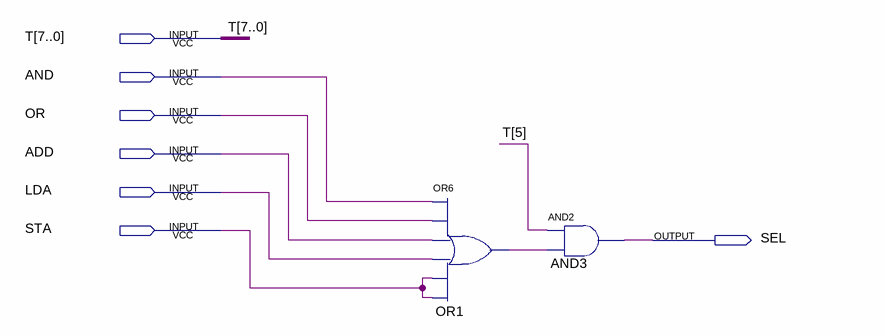
[diagram p0: schematic sheet]
// Quartus schematic SEL.bdf as structural Verilog: 2 symbols, 7 pins
module SEL (
  input  [7:0] T,
  input  AND,
  input  OR,
  input  ADD,
  input  LDA,
  input  STA,
  output SEL
);

  wire OR1_out;

  or OR1 (OR1_out, AND, OR, ADD, LDA, STA, STA);
  and AND3 (SEL, T[5], OR1_out);
endmodule
